# EAGLE design ai_breakout_LSM9DS0 (EAGLE 7.1.0)
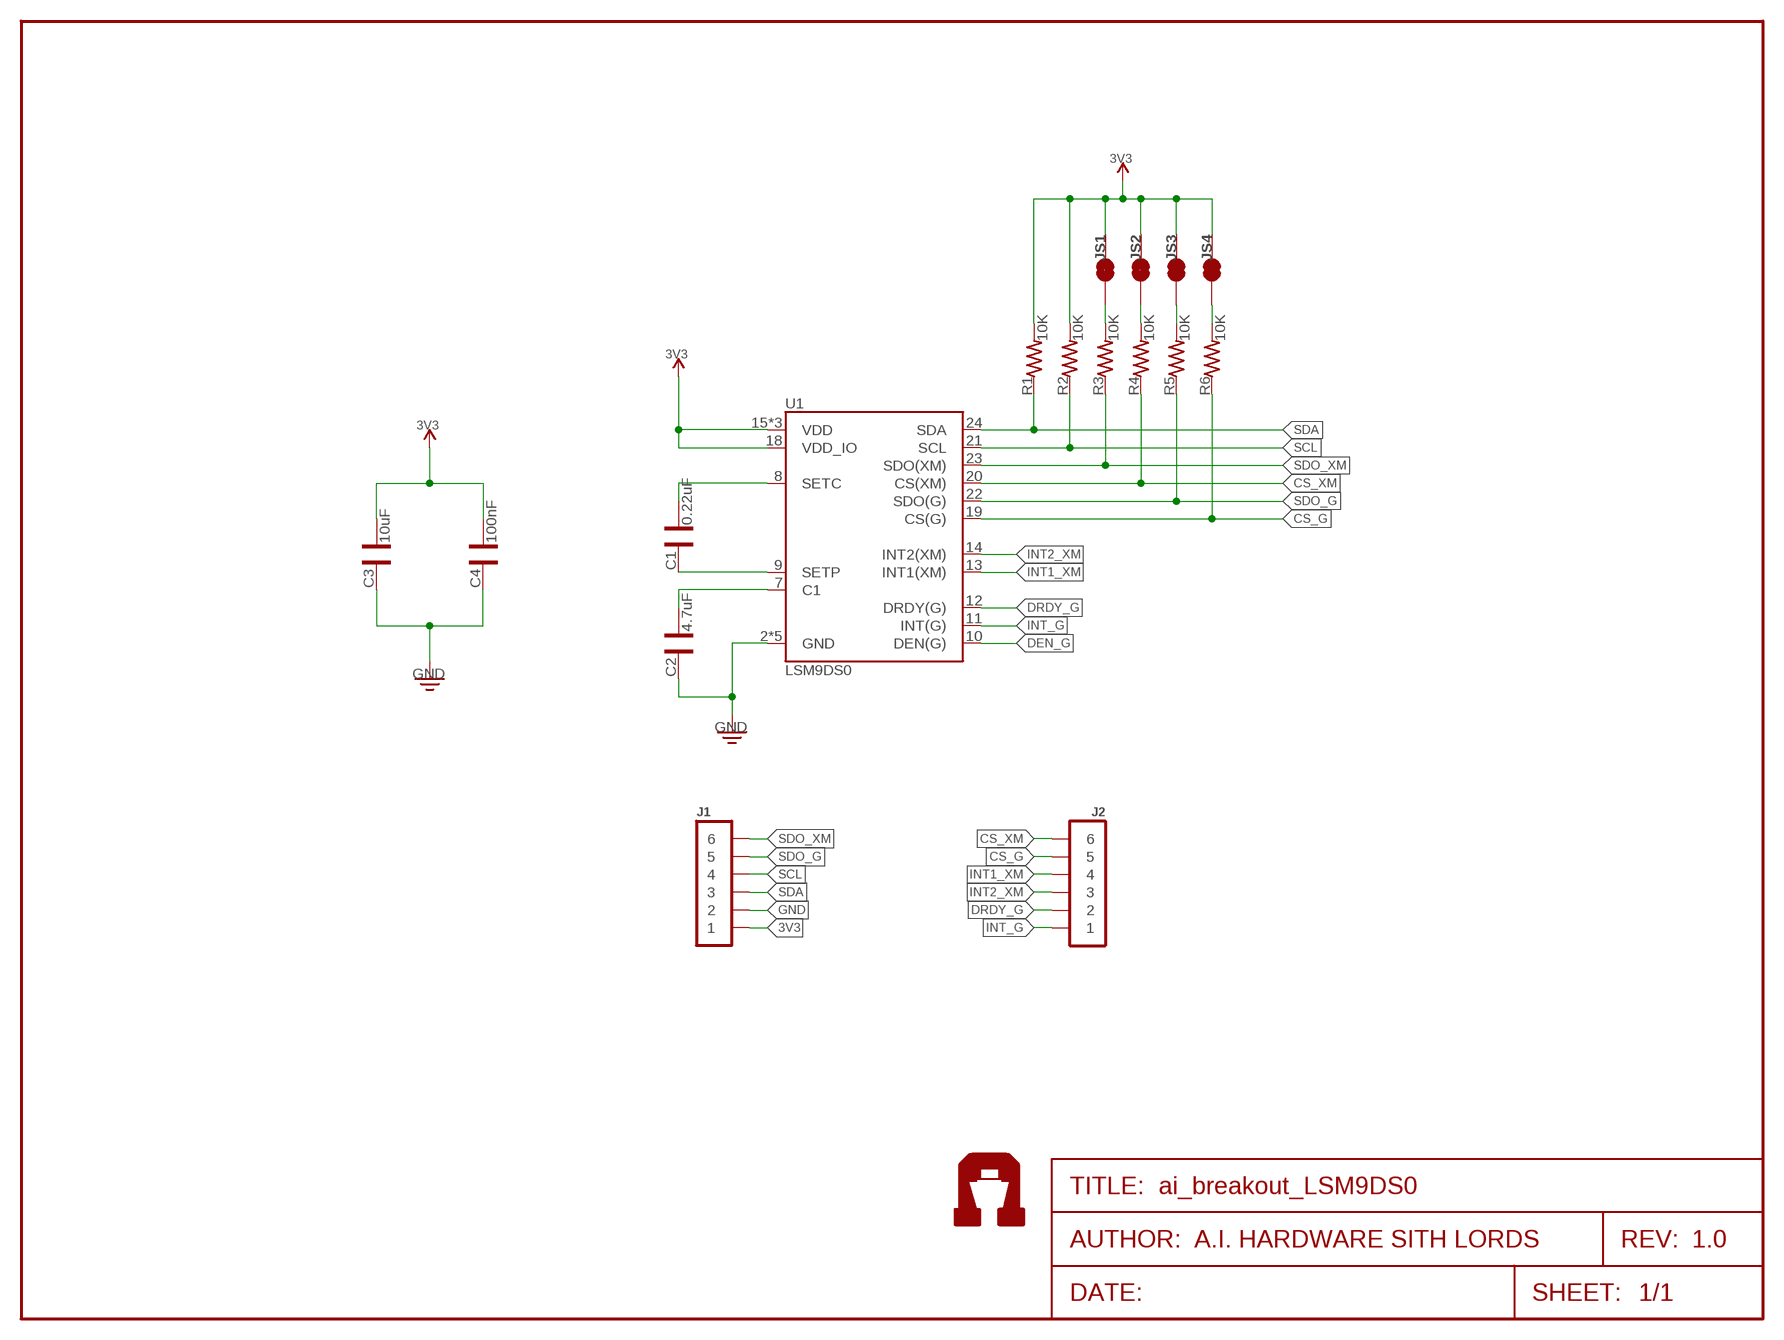
[diagram p0: schematic, sheet 1]
FRAME1 (FRAME-LETTER): AUTHOR: A.I. HARDWARE SITH LORDS; REV: 1.0

## Parts
C1  0.22uF  CAP0603  [CAP-0603]
C2  4.7uF  CAP0603  [CAP-0603]
C3  10uF  CAP0603  [CAP-0603]
C4  100nF  CAP0603  [CAP-0603]
J1  1X06  [1X06]
J2  1X06NOFIRST  [1X06-NOFIRST]
JS1  1X02-SJ-NCT  [1X02-SJ-NCT]
JS2  1X02-SJ-NCT  [1X02-SJ-NCT]
JS3  1X02-SJ-NCT  [1X02-SJ-NCT]
JS4  1X02-SJ-NCT  [1X02-SJ-NCT]
R1  10K  RES0603  [RES-0603]
R2  10K  RES0603  [RES-0603]
R3  10K  RES0603  [RES-0603]
R4  10K  RES0603  [RES-0603]
R5  10K  RES0603  [RES-0603]
R6  10K  RES0603  [RES-0603]
U1  LSM9DS0  [LGA-24]
U$4  AI-LOGOXS  [AI-LOGO-XS]

## Nets
3V3: C3.1 C4.1 J1.1 JS1.2 JS2.2 JS3.2 JS4.2 R1.2 R2.2 U1.15(VDD) U1.16(VDD) U1.17(VDD) U1.18(VDD_IO)
CS_G: J2.5 R6.1 U1.19(CS(G))
CS_XM: J2.6 R4.1 U1.20(CS(XM))
DEN_G: U1.10(DEN(G))
DRDY_G: J2.2 U1.12(DRDY(G))
GND: C2.2 C3.2 C4.2 J1.2 U1.2(GND) U1.3(GND) U1.4(GND) U1.5(GND) U1.6(GND)
INT1_XM: J2.4 U1.13(INT1(XM))
INT2_XM: J2.3 U1.14(INT2(XM))
INT_G: J2.1 U1.11(INT(G))
N$1: C1.1 U1.8(SETC)
N$2: C1.2 U1.9(SETP)
N$3: C2.1 U1.7(C1)
N$10: JS1.1 R3.2
N$11: JS2.1 R4.2
N$12: JS3.1 R5.2
N$13: JS4.1 R6.2
SCL: J1.4 R2.1 U1.21(SCL)
SDA: J1.3 R1.1 U1.24(SDA)
SDO_G: J1.5 R5.1 U1.22(SDO(G))
SDO_XM: J1.6 R3.1 U1.23(SDO(XM))

## Library data of the parts
C1-C4 = Ai_Passives:CAP
J1 J2 = Ai_Connectors:1X06
JS1-JS4 = Ai_Connectors:1X02-SJ-NC: Solder Jumper Normally closed versions.
R1-R6 = Ai_Passives:RES: Part # blah Digikey
U1 = Ai_Sensors:LSM9DS0
U$4 = Ai_Miscellany:AI-LOGO

## Net classes
0 default: width 0.203 mm, drill 0.381 mm, clearance 0.152 mm

## Board
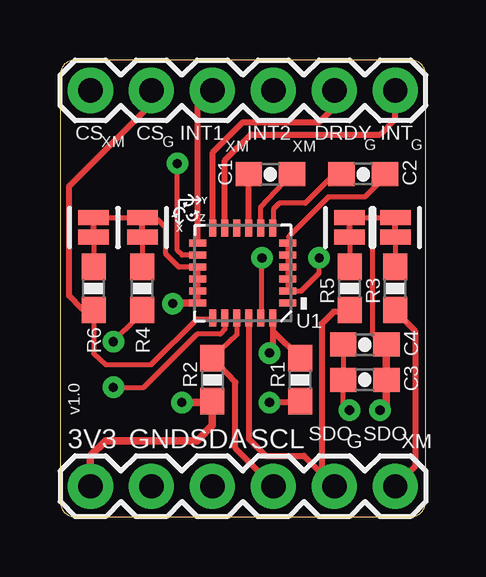
[diagram p1: board, top side]
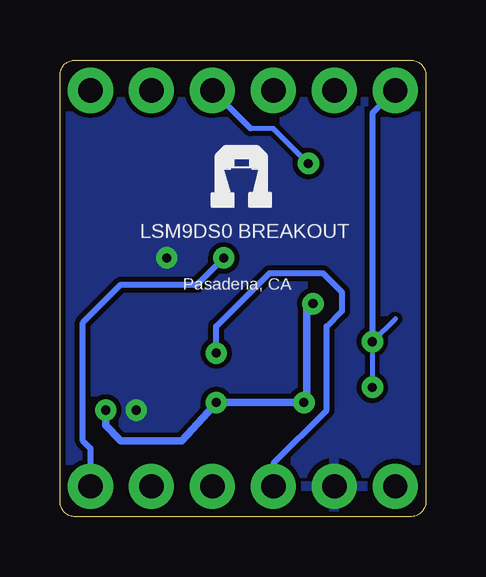
[diagram p2: board, bottom side, seen from below]

Size 15.24 x 19.05 mm. Coordinates in mm from the lower left corner, seen from the top.
Outline: 0,18.41 0,0.64 arc90 0.64,0 14.61,0 arc90 15.24,0.64 15.24,18.41 arc90 14.61,19.05 0.64,19.05 arc90 0,18.41
Copper layers (1*16): Top 0.035mm / dielectric 1.5mm / Bottom 0.035mm
Design rules "ai_2layer": minimum track width 7mil, minimum drill 15mil, track to track 8mil, track to pad 8mil, pad to pad 8mil, via to via 8mil, smd to smd 8mil, copper to edge 8mil, drill to drill 8mil, minimum pad ring 12mil, minimum via ring 10mil, stop-mask expansion 4mil, vias tented up to drill 20mil, thermal gap 10mil

### Footprints (pad centres in the part's own frame; a part is rotated, then mirrored left to right if it is on the bottom)
CAP-0603 = smd 1.1 x 1: 1 -0.9,0; 2 0.9,0
1X06 = drill 1.016 pad 1.88: 1 -6.35,0; 2 -3.81,0; 3 -1.27,0; 4 1.27,0; 5 3.81,0; 6 6.35,0
1X06-NOFIRST = drill 1.016 pad 1.88: 1 -6.35,0; 2 -3.81,0; 3 -1.27,0; 4 1.27,0; 5 3.81,0; 6 6.35,0
1X02-SJ-NCT = smd 0.635 x 1.27: 1 -0.401,0; 2 0.413,0
RES-0603 = smd 1.1 x 1: 1 -0.9,0; 2 0.9,0
LGA-24 = smd 0.7 x 0.29: 1 -1.875,1.25; 2 -1.875,0.75; 3 -1.875,0.25; 4 -1.875,-0.25; 5 -1.875,-0.75; 6 -1.875,-1.25; 13 1.875,-1.25; 14 1.875,-0.75; 15 1.875,-0.25; 16 1.875,0.25; 17 1.875,0.75; 18 1.875,1.25 | smd 0.29 x 0.7: 7 -1.25,-1.875; 8 -0.75,-1.875; 9 -0.25,-1.875; 10 0.25,-1.875; 11 0.75,-1.875; 12 1.25,-1.875; 19 1.25,1.875; 20 0.75,1.875; 21 0.25,1.875; 22 -0.25,1.875; 23 -0.75,1.875; 24 -1.25,1.875

### Placement (x,y rotation side)
C1  8.76,14.29 180 top
C2  12.64,14.29 0 top
C3  12.7,5.71 180 top
C4  12.7,7.18 180 top
J1  7.62,1.27 0 top
J2  7.62,17.78 180 top
JS1  13.97,12.06 90 top
JS2  3.43,12.06 90 top
JS3  12.06,12.06 90 top
JS4  1.4,12.06 90 top
R1  10,5.71 270 top
R2  6.35,5.71 270 top
R3  13.97,9.53 90 top
R4  3.43,9.53 90 top
R5  12.06,9.53 90 top
R6  1.4,9.53 90 top
U1  7.62,10.16 180 top
U$4  9.02,12.83 0 bottom

### Tracks (layer width: path | path; a pad name or v marks a point on that pad's centre or on a via)
3V3  (via drill 0.38)
  Top 0.203: JS3.2 13.02,12.48 | 13.02,12.48 JS1.2 | JS4.2 JS2.2 3.27,12.38 4.1,12.38 4.41,12.06 4.41,10.95 4.96,10.41 U1.15 U1.16 U1.17 U1.18 | 13.55,7.41 C4.1 13.02,7.63 13.02,12.48
  Top 0.254: R1.2 9.95,4.76 v8.73,4.76
  Top 0.305: U1.18 4.72,8.91 v4.7,8.89 | C4.1 C3.1 13.6,4.71 v13.34,4.45 | J1.1 1.27,2.54 1.91,3.17 5.71,3.17 6.35,3.81 R2.2 6.35,4.76 v5.08,4.76
  Bottom 0.305: v4.7,8.89 4.95,8.64 4.95,4.89 v5.08,4.76 v8.73,4.76 8.86,4.6 10.16,3.17 12.7,3.17 13.34,3.81 v13.34,4.45
CS_G
  Top 0.203: 0.91,8.68 R6.1 1.4,6.81 1.91,6.35 3.81,6.35 5.71,8.26 6.34,8.26 U1.19
  Top 0.254: 0.91,8.68 0.38,9.21 0.38,13.78 3.81,17.21 J2.5
CS_XM  (via drill 0.38)
  Top 0.203: U1.20 6.87,7.82 6.67,7.62 5.71,7.62 3.49,5.4 v2.22,5.4 | R4.1 3.17,8.26 v2.22,7.3
  Bottom 0.203: v2.22,5.4 v2.22,7.3 1.27,8.26
  Bottom 0.254: J2.6 2.22,16.83 v2.22,7.3
DRDY_G
  Top 0.254: U1.12 6.37,15.2 7.62,16.45 10.79,16.45 11.43,17.08 J2.2
GND  (via drill 0.38)
  Top 0.203: C2.2 13.87,14.5 12.7,13.34 11.18,13.34 9.53,11.68 9.53,11.44 U1.6 U1.5 U1.4 U1.3 U1.2 10.04,9.41 10.79,10.16 v10.79,10.79 | 11.85,7.2 C4.2 C3.2 11.8,4.71 v12.06,4.45
  pour Bottom: 0,19.05 0,0 15.24,0 15.24,19.05
INT1_XM
  Top 0.254: U1.13 5.75,17.18 J2.4
INT2_XM  (via drill 0.38)
  Top 0.203: U1.14 5.09,10.91 4.89,11.11 v4.89,14.73
  Bottom 0.203: 7.3,16.19 6.35,16.19 v4.89,14.73
  Bottom 0.254: J2.3 7.3,16.19
INT_G
  Top 0.254: U1.11 6.87,14.87 7.94,15.94 13.34,15.94 13.97,16.57 J2.1
N$1
  Top 0.203: U1.8 8.37,12.92 C1.1
N$2
  Top 0.254: U1.9 C1.2
N$3
  Top 0.203: C2.1 11.43,14.29 10.22,13.08 9.14,13.08 8.89,12.83 8.89,12.05 U1.7
N$10
  Top 0.203: JS1.1 R3.2
N$11
  Top 0.203: JS2.1 R4.2
N$12
  Top 0.203: JS3.1 R5.2
N$13
  Top 0.203: JS4.1 R6.2
SCL
  Top 0.203: U1.21 7.37,7.58 R2.1
  Top 0.254: R2.1 7.3,5.61 7.3,2.86 J1.4
SDA  (via drill 0.38)
  Top 0.203: R1.1 10.16,6.51
  Top 0.254: U1.24 8.87,7.75 | 8.87,7.75 8.87,6.96 v8.73,6.83 | R1.1 8.87,7.75
  Bottom 0.254: v8.73,6.83 8.73,7.94 6.51,10.16 4.29,10.16 3.49,9.37 3.49,8.57 4.13,7.94 4.13,4.45 6.35,2.22 J1.3
SDO_G
  Top 0.254: 10.9,1.8 10.16,2.54 8.57,2.54 7.87,3.24 U1.22 | 10.9,1.8 10.9,8.04 11.4,8.55 11.99,8.55 R5.1 | 10.9,1.8 J1.5
SDO_XM  (via drill 0.38)
  Top 0.203: U1.23 8.41,8.33 v8.41,10.79
  Top 0.254: J1.6 14.8,2.1 14.8,7.75 13.97,8.57 R3.1
  Bottom 0.254: v8.41,10.79 9.53,9.68 12.7,9.68 14.29,8.1 14.29,3.17 13.97,2.86 J1.6

### Text on the board
tPlace: CS | CS | INT1 | INT2 | DRDY | INT | XM | G | XM | XM | G | G | v1.0 | 3V3 | GND | SDA | SCL | SDO | G | SDO | XM
bPlace: LSM9DS0 BREAKOUT | Pasadena, CA